# Altium schematic sheet [09]-FPGA_Bank_2_Interface.SchDoc
size A4
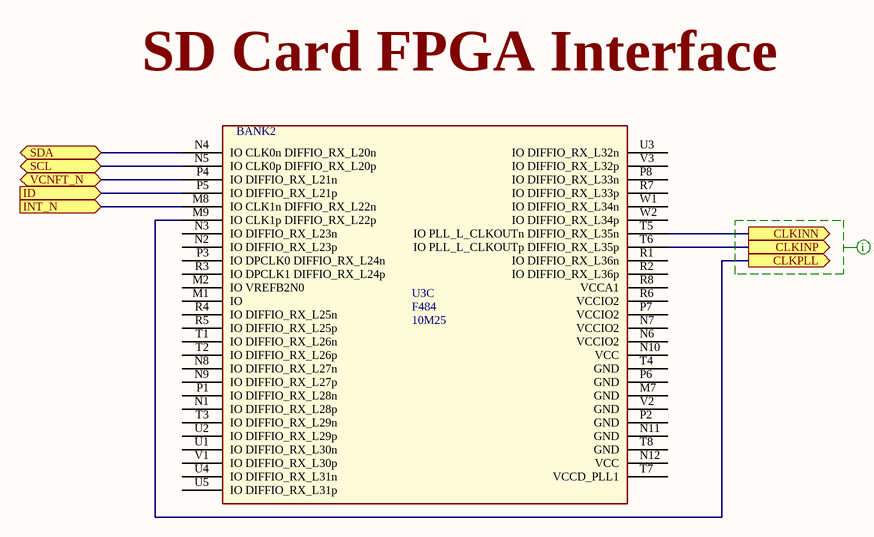
[diagram p0: [09]-FPGA_Bank_2_Interface.SchDoc]

## Parts
U3  10M25  Package Type: F484  [*BGA484C100P22X22_2300X2300X200N]  (part C of 9)

## Ports
CLKINN (out), CLKINP (out), CLKPLL (out), ID (in), INT_N (in), SCL (bidir), SDA (bidir), VCNFT_N (bidir)

## Nets
CLKINN: U3.T5(IO_PLL_L_CLKOUTn_DIFFIO_RX_L35n) ; port CLKINN
CLKINP: U3.T6(IO_PLL_L_CLKOUTp_DIFFIO_RX_L35p) ; port CLKINP
CLKPLL: U3.M9(IO_CLK1p_DIFFIO_RX_L22p) ; port CLKPLL
ID: U3.P5(IO_DIFFIO_RX_L21p) ; port ID
INT_N: U3.M8(IO_CLK1n_DIFFIO_RX_L22n) ; port INT_N
SCL: U3.N5(IO_CLK0p_DIFFIO_RX_L20p) ; port SCL
SDA: U3.N4(IO_CLK0n_DIFFIO_RX_L20n) ; port SDA
VCNFT_N: U3.P4(IO_DIFFIO_RX_L21n) ; port VCNFT_N

Not connected (* = marked no-connect by the designer): U3 M1(IO) M2(IO_VREFB2N0) M7(GND) N1(IO_DIFFIO_RX_L28p) N2(IO_DIFFIO_RX_L23p) N3(IO_DIFFIO_RX_L23n) N6(VCCIO2) N7(VCCIO2) N8(IO_DIFFIO_RX_L27n) N9(IO_DIFFIO_RX_L27p) N10(VCC) N11(GND) N12(VCC) P1(IO_DIFFIO_RX_L28n) P2(GND) P3(IO_DPCLK0_DIFFIO_RX_L24n) P6(GND) P7(VCCIO2) P8(IO_DIFFIO_RX_L33n) R1(IO_DIFFIO_RX_L36n) R2(IO_DIFFIO_RX_L36p) R3(IO_DPCLK1_DIFFIO_RX_L24p) R4(IO_DIFFIO_RX_L25n) R5(IO_DIFFIO_RX_L25p) R6(VCCIO2) R7(IO_DIFFIO_RX_L33p) R8(VCCA1) T1(IO_DIFFIO_RX_L26n) T2(IO_DIFFIO_RX_L26p) T3(IO_DIFFIO_RX_L29n) T4(GND) T7(VCCD_PLL1) T8(GND) U1(IO_DIFFIO_RX_L30n) U2(IO_DIFFIO_RX_L29p) U3(IO_DIFFIO_RX_L32n) U4(IO_DIFFIO_RX_L31n) U5(IO_DIFFIO_RX_L31p) V1(IO_DIFFIO_RX_L30p) V2(GND) V3(IO_DIFFIO_RX_L32p) W1(IO_DIFFIO_RX_L34n) W2(IO_DIFFIO_RX_L34p)

## Layout directives
mark named Input Clocks: (no net found under the mark)

## Notes on the sheet
- SD Card FPGA Interface
- (in symbol Component_1, part C) BANK2

## Library data of the parts
U3 = Component_1: Part no.: 10M25DAF484I7G